# Altium schematic sheet cSLIM_RS485.SchDoc
size 297 x 210 mm; SheetNumber: 4; SheetTotal: 12
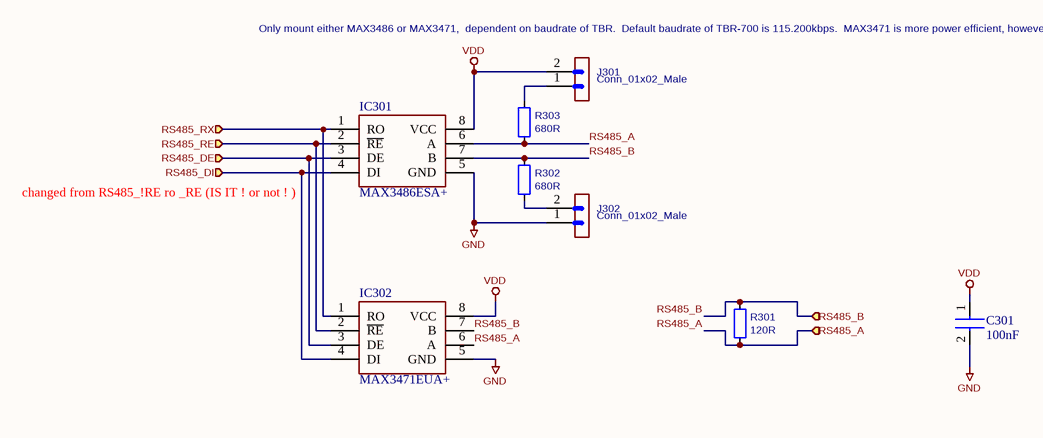
[diagram p0: cSLIM_RS485.SchDoc]

## Parts
C301  100nF  [CAPC1608X90N]
IC301  MAX3486ESA+  [SOIC127P600X175-8N]
IC302  MAX3471EUA+  [SOP65P490X110-8N]
J301  Conn_01x02_Male  [HDRV2W110P0X254_1X2_508X254X854P]
J302  Conn_01x02_Male  [HDRV2W110P0X254_1X2_508X254X854P]
R301  120R  [RESC1608X55N]
R302  680R  [RESC1608X55N]
R303  680R  [RESC1608X55N]

## Ports
RS485_A (in), RS485_B (in), RS485_DE (in), RS485_DI (in), RS485_RE (in), RS485_RX (in)

## Nets
GND: C301.2 IC301.5(GND) IC302.5(GND) J302.1
VDD: C301.1 IC301.8(VCC) IC302.8(VCC) J301.2
RS485_A: IC301.6(A) IC302.6(A) R301.2 R303.2 ; port RS485_A
RS485_B: IC301.7(B) IC302.7(B) R301.1 R302.1 ; port RS485_B
RS485_DE: IC301.3(DE) IC302.3(DE) ; port RS485_DE
RS485_DI: IC301.4(DI) IC302.4(DI) ; port RS485_DI
RS485_RE: IC301.2(~{RE}) IC302.2(~{RE}) ; port RS485_RE
RS485_RX: IC301.1(RO) IC302.1(RO) ; port RS485_RX
NetJ301_1: J301.1 R303.1
NetJ302_2: J302.2 R302.2

## Notes on the sheet
- (near J301) Only mount either MAX3486 or MAX3471,
  dependent on baudrate of TBR.
  Default baudrate of TBR-700 is 115.200kbps.
  MAX3471 is more power efficient, however
  it has a maximum baud of 64kbps.
- (near IC301) changed from RS485_!RE ro _RE (IS IT ! or not ! )
- 1
- 2
- 3
- 4
- 5
- 6
- A
- B
- C
- Eivind Jølsgard
- D
- Title: cSLIM RS485
- File: cSLIM_RS485.sch
- Sheet: /
- NTNU
- KiCad E.D.A.  kicad (5.1.4)-1
- Size: A4
- Date: 2021-06-30
- Rev: v1.1
- Id: 3/11

## Library data of the parts
C301 = C: Capacitor; Manufacturer_Name: AVX; Manufacturer_Part_Number: 06033G104ZAT2A; Datasheet Link: http://www.mouser.com/catalog/supplier/library/pdf/AVXSurfaceMountCeramic.pdf; Height: 0.9mm; Mouser Part Number: 581-06033G104Z; Mouser Price/Stock: https://www.mouser.co.uk/ProductDetail/AVX/06033G104ZAT2A?qs=NXubJDmysXJMPmHfVo6Z%252BA%3D%3D; Arrow Part Number: 06033G104ZAT2A; Arrow Price/Stock: https://www.arrow.com/en/products/06033g104zat2a/avx?region=nac
IC301 = MAX3486ESA+: Integrated Circuit; Manufacturer_Name: Maxim Integrated; Datasheet Link: http://datasheets.maximintegrated.com/en/ds/MAX3483-MAX3491.pdf; Height: 1.75mm; Manufacturer_Part_Number: MAX3486ESA+; Mouser Part Number: 700-MAX3486ESA; Mouser Price/Stock: https://www.mouser.co.uk/ProductDetail/Maxim-Integrated/MAX3486ESA%2b?qs=1THa7WoU59FIrgcgBLF9fg%3D%3D
IC302 = MAX3471EUA+: Integrated Circuit; Manufacturer_Name: Maxim Integrated; Datasheet Link: http://docs-emea.rs-online.com/webdocs/0f71/0900766b80f719c9.pdf; Height: 1.1mm; Manufacturer_Part_Number: MAX3471EUA+; Mouser Part Number: 700-MAX3471EUA; Mouser Price/Stock: https://www.mouser.co.uk/ProductDetail/Maxim-Integrated/MAX3471EUA%2b?qs=1THa7WoU59GPWTW%252BBV1kJA%3D%3D
J301 J302 = 61300211121: Connector; Manufacturer_Name: Wurth Elektronik; Datasheet Link: https://componentsearchengine.com/Datasheets/2/61300211121.pdf; Height: 8.54mm; Manufacturer_Part_Number: 61300211121; Mouser Part Number: 710-61300211121; Mouser Price/Stock: https://www.mouser.co.uk/ProductDetail/Wurth-Elektronik/61300211121?qs=t4813l51qx%252B1A5GYDQxPlw%3D%3D
R301-R303 = R
  R301: Value: 120R
  R302 R303: Value: 680R